# EAGLE design microsd-breakout (EAGLE 9.3.0)
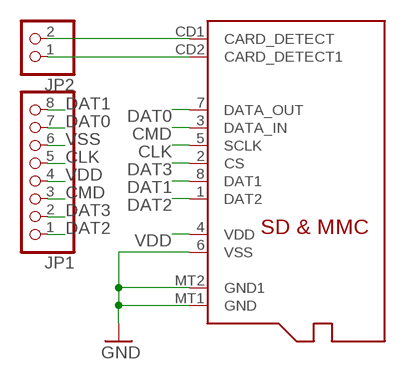
[diagram p0: schematic, sheet 1]

## Parts
JP1  PINHD-1X8/90  [1X08/90]
JP2  PINHD-1X2/90  [1X02/90]
U$1  MICROSD  [MICROSD]

## Nets
CLK: JP1.5 U$1.5(SCLK)
CMD: JP1.3 U$1.3(DATA_IN)
DAT0: JP1.7 U$1.7(DATA_OUT)
DAT1: JP1.8 U$1.8(DAT1)
DAT2: JP1.1 U$1.1(DAT2)
DAT3: JP1.2 U$1.2(CS)
N$1: JP2.1 U$1.CD2(CARD_DETECT1)
N$2: JP2.2 U$1.CD1(CARD_DETECT)
VDD: JP1.4 U$1.4(VDD)
VSS: JP1.6 U$1.6(VSS) U$1.MT1(GND) U$1.MT2(GND1) ; supply symbol labelled GND

## Library data of the parts
JP1 = pinhead:PINHD-1X8: PIN HEADER
JP2 = pinhead:PINHD-1X2: PIN HEADER
U$1 = adafruit:MICROSD: Micro-SD / Transflash card holder with SPI pinout For the 3M # 2908-05WB-MG and/or 4UCON #19656 push-push type

## Board
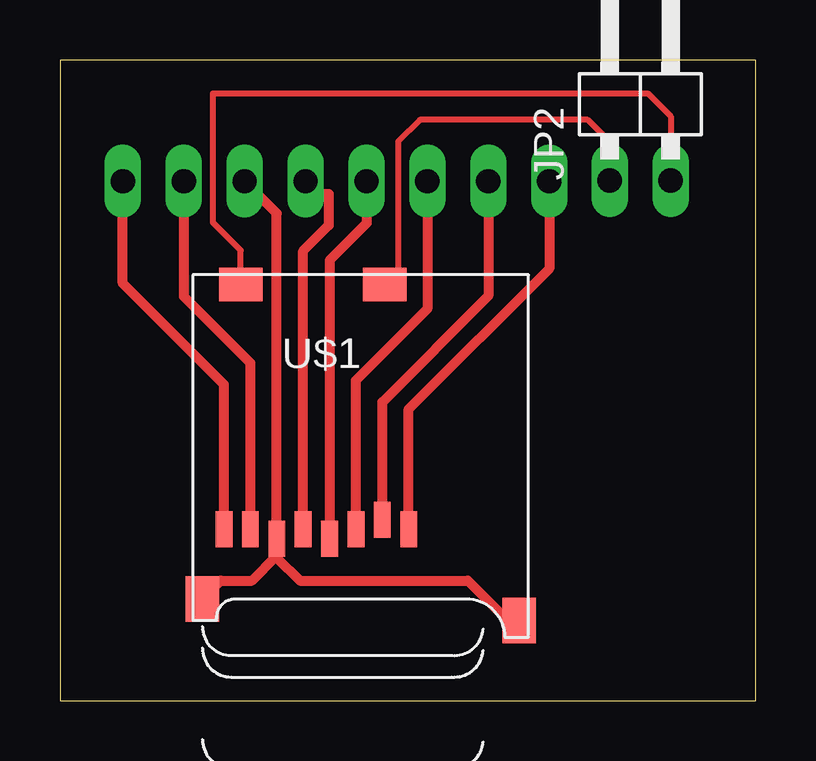
[diagram p1: board, top side]
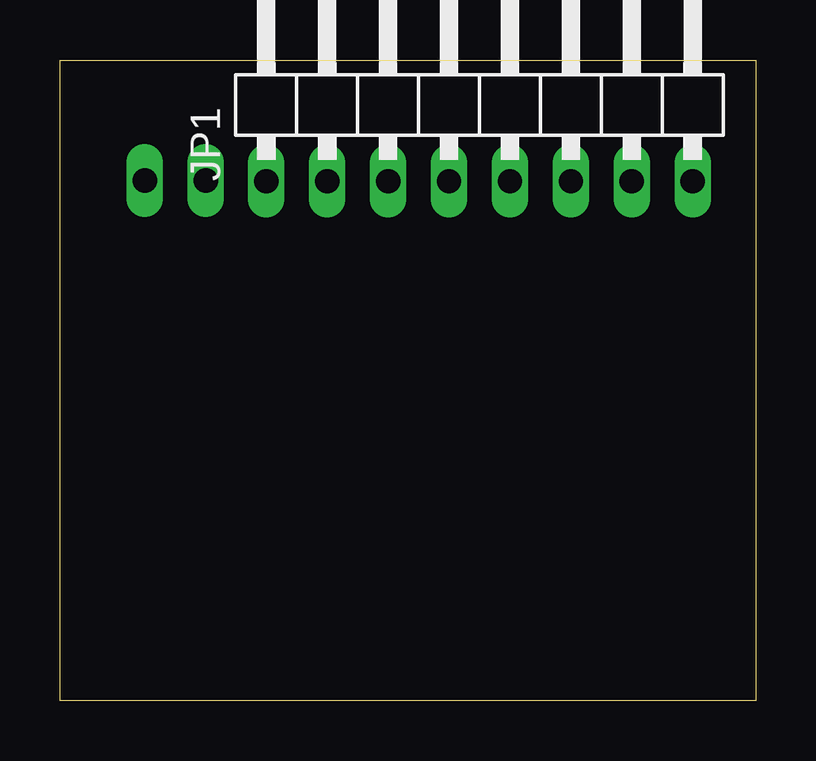
[diagram p2: board, bottom side, seen from below]

Size 29 x 26.69 mm. Coordinates in mm from the lower left corner, seen from the top.
Outline: 0,0 29,0 29,26.69 0,26.69 0,0
Copper layers (1*16): Top 0.035mm / dielectric 1.5mm / Bottom 0.035mm
Design rules "default": minimum track width 6mil, minimum drill 0.35mm, track to track 6mil, track to pad 6mil, pad to pad 6mil, via to via 6mil, smd to smd 6mil, copper to edge 40mil, drill to drill 6mil, minimum pad ring 10mil, minimum via ring 8mil, stop-mask expansion 4mil, vias tented up to drill 0mil, thermal gap 10mil

### Footprints (pad centres in the part's own frame; a part is rotated, then mirrored left to right if it is on the bottom)
1X08/90 = drill 1.016 long: 1 -8.89,-3.81; 2 -6.35,-3.81; 3 -3.81,-3.81; 4 -1.27,-3.81; 5 1.27,-3.81; 6 3.81,-3.81; 7 6.35,-3.81; 8 8.89,-3.81
1X02/90 = drill 1.016 long: 1 -1.27,-3.81; 2 1.27,-3.81
MICROSD = smd 0.7 x 1.5: 1 9,-10.64; 2 7.9,-10.24; 3 6.8,-10.64; 4 5.7,-11.04; 5 4.6,-10.64; 6 3.5,-11.04; 7 2.4,-10.64; 8 1.3,-10.64 | smd 1.8 x 1.4: CD1 2,-0.44; CD2 8,-0.44 | smd 1.4 x 1.9: MT1 0.4,-13.54; MT2 13.6,-14.44

### Placement (x,y rotation side)
JP1  11.51,25.45 0 bottom
JP2  24.19,25.48 0 top
U$1  5.54,17.78 0 top

### Tracks (layer width: path | path; a pad name or v marks a point on that pad's centre or on a via)
CLK
  Top 0.406: U$1.5 10.14,18.74 11.2,19.8 11.2,21.1 10.78,21.1 JP1.5
CMD
  Top 0.406: U$1.3 12.34,13.34 15.32,16.32 JP1.3
DAT0
  Top 0.406: JP1.7 5.16,16.84 7.94,14.06 U$1.7
DAT1
  Top 0.406: U$1.8 6.84,13.16 2.62,17.38 JP1.8
DAT2
  Top 0.406: U$1.1 14.54,12.14 20.4,18 JP1.1
DAT3
  Top 0.406: U$1.2 13.44,12.44 17.86,16.86 JP1.2
N$1
  Top 0.254: JP2.1 22.92,23.28 22,24.2 15,24.2 14.1,23.3 14.1,17.3 13.58,17.3 U$1.CD2
N$2
  Top 0.254: U$1.CD1 7.54,18.76 6.38,19.91 6.38,25.3 24.5,25.3 25.46,24.34 JP2.2
VDD
  Top 0.406: U$1.4 11.24,18.34 12.8,19.9 12.8,21.62 JP1.4
VSS
  Top 0.406: JP1.6 9.04,20.3 U$1.6 | U$1.MT1 6.7,5 8,5 9.04,6.04 U$1.6 | U$1.6 9.04,5.96 10,5 17,5 18.66,3.34 U$1.MT2